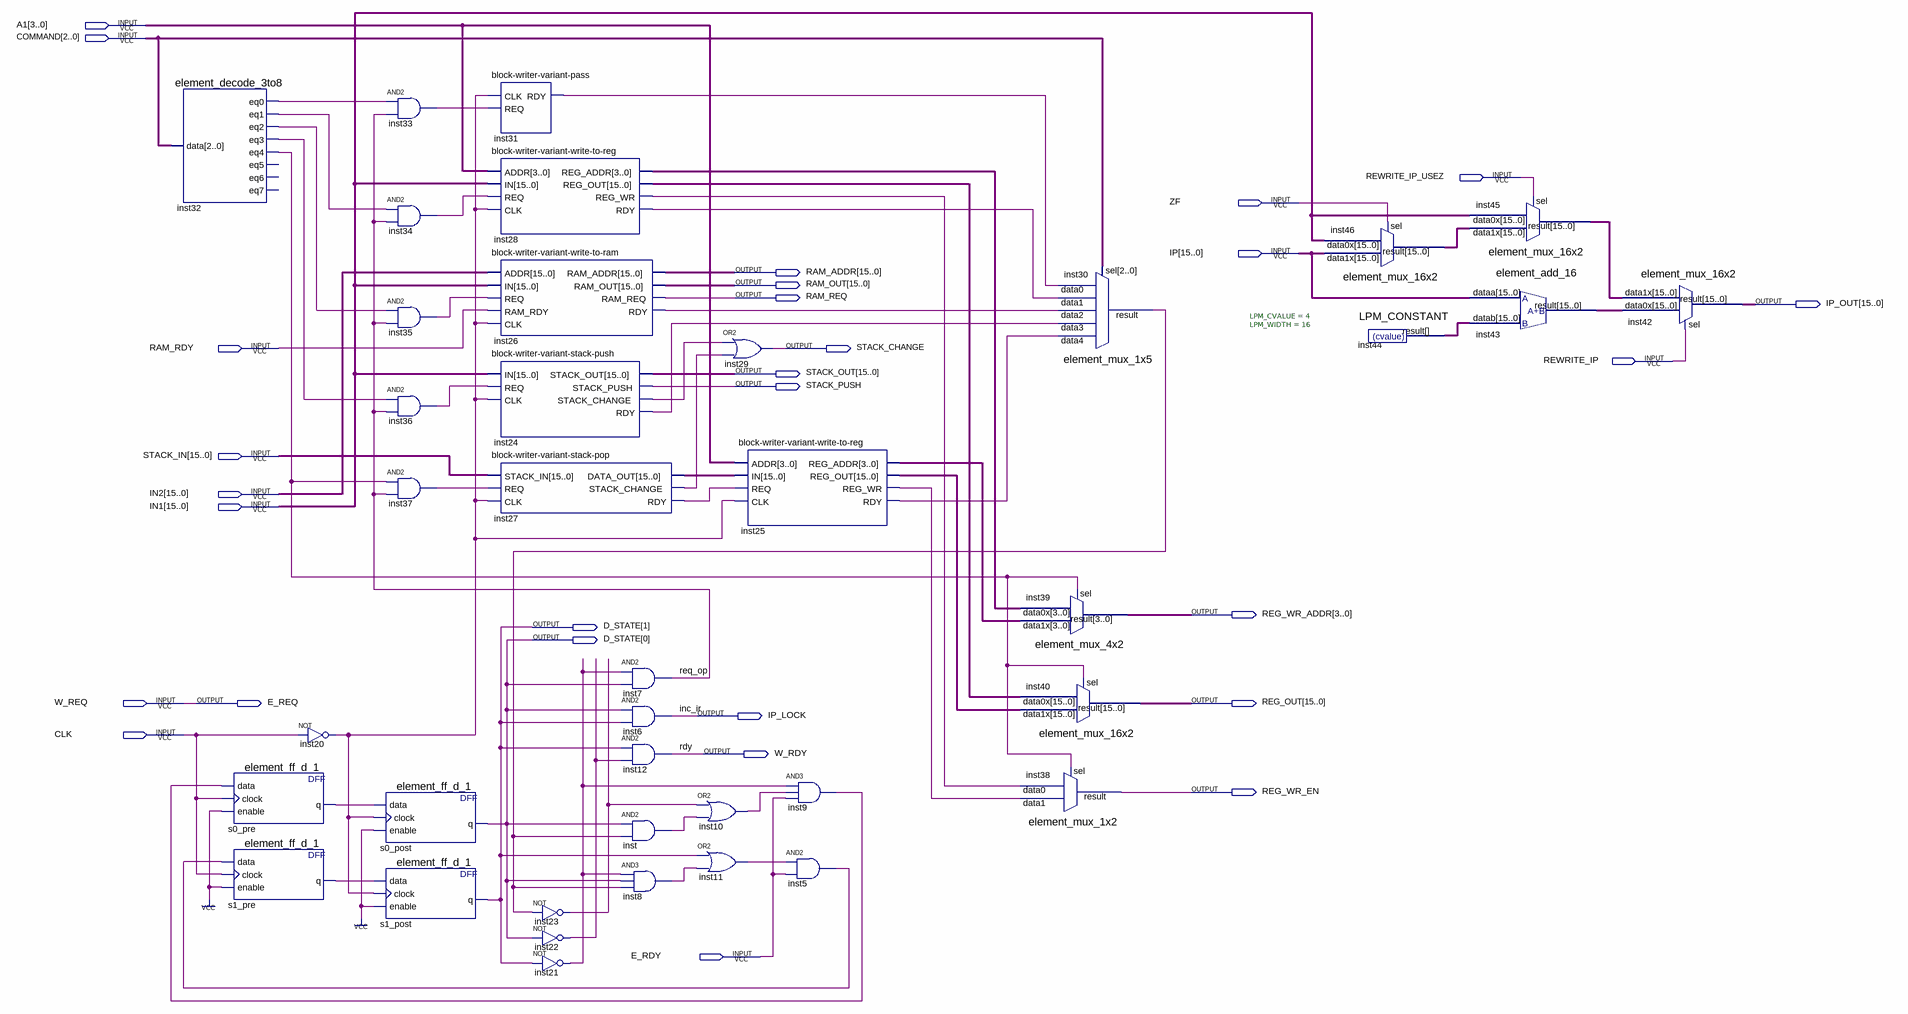
[diagram p0: schematic sheet]
// Quartus schematic block-stage-data-write.bdf as structural Verilog: 39 symbols, 28 pins
module \block-stage-data-write  (
  input  [3:0] A1,
  input  [2:0] COMMAND,
  input  REWRITE_IP_USEZ,
  input  ZF,
  input  [15:0] IP,
  input  RAM_RDY,
  input  REWRITE_IP,
  input  [15:0] STACK_IN,
  input  [15:0] IN2,
  input  [15:0] IN1,
  input  W_REQ,
  input  CLK,
  input  E_RDY,
  output [15:0] RAM_ADDR,
  output [15:0] RAM_OUT,
  output RAM_REQ,
  output [15:0] IP_OUT,
  output STACK_CHANGE,
  output [15:0] STACK_OUT,
  output STACK_PUSH,
  output [3:0] REG_WR_ADDR,
  output [1:0] D_STATE,
  output E_REQ,
  output [15:0] REG_OUT,
  output IP_LOCK,
  output W_RDY,
  output REG_WR_EN
);

  wire inst5_out, inst8_out, inst9_out, inst10_out, inst11_out, inst20_out, inst21_out, inst22_out,
       inst23_out, inst24_rdy, inst24_stack_change, inst25_rdy, inst25_reg_wr, inst26_rdy, inst27_rdy,
       inst27_stack_change, inst28_rdy, inst28_reg_wr, inst30_result, inst31_rdy, inst32_eq0, inst32_eq1,
       inst32_eq2, inst32_eq3, inst32_eq4, inst33_out, inst34_out, inst35_out, inst36_out, inst37_out,
       inst_out, req_op, s0_pre_q, s1_pre_q;
  wire [3:0] inst25_reg_addr, inst28_reg_addr;
  wire [15:0] inst25_reg_out, inst27_data_out, inst28_reg_out, inst43_result, inst44_result, inst45_result,
       inst46_result;

  element_decode_3to8 inst32 (
    .data(COMMAND), .eq0(inst32_eq0), .eq1(inst32_eq1), .eq2(inst32_eq2), .eq3(inst32_eq3), .eq4(inst32_eq4));  // open: eq5, eq6, eq7
  element_ff_d_1 s0_pre (.data(inst9_out), .clock(CLK), .enable(1'b1), .q(s0_pre_q));
  element_ff_d_1 s1_pre (.data(inst5_out), .clock(CLK), .enable(1'b1), .q(s1_pre_q));
  not inst20 (inst20_out, CLK);
  element_ff_d_1 s0_post (.data(s0_pre_q), .clock(inst20_out), .enable(1'b1), .q(D_STATE[0]));
  element_ff_d_1 s1_post (.data(s1_pre_q), .clock(inst20_out), .enable(1'b1), .q(D_STATE[1]));
  and inst33 (inst33_out, inst32_eq0, req_op);
  and inst34 (inst34_out, inst32_eq1, req_op);
  and inst35 (inst35_out, inst32_eq2, req_op);
  and inst36 (inst36_out, inst32_eq3, req_op);
  and inst37 (inst37_out, inst32_eq4, req_op);
  \block-writer-variant-pass  inst31 (.CLK(inst20_out), .REQ(inst33_out), .RDY(inst31_rdy));
  \block-writer-variant-write-to-reg  inst28 (
    .ADDR(A1), .IN(IN1), .REQ(inst34_out), .CLK(inst20_out), .REG_ADDR(inst28_reg_addr),
    .REG_OUT(inst28_reg_out), .REG_WR(inst28_reg_wr), .RDY(inst28_rdy));
  \block-writer-variant-write-to-ram  inst26 (
    .ADDR(IN2), .IN(IN1), .REQ(inst35_out), .RAM_RDY(RAM_RDY), .CLK(inst20_out), .RAM_ADDR(RAM_ADDR),
    .RAM_OUT(RAM_OUT), .RAM_REQ(RAM_REQ), .RDY(inst26_rdy));
  \block-writer-variant-stack-push  inst24 (
    .IN(IN1), .REQ(inst36_out), .CLK(inst20_out), .STACK_OUT(STACK_OUT), .STACK_PUSH(STACK_PUSH),
    .STACK_CHANGE(inst24_stack_change), .RDY(inst24_rdy));
  \block-writer-variant-stack-pop  inst27 (
    .STACK_IN(STACK_IN), .REQ(inst37_out), .CLK(inst20_out), .DATA_OUT(inst27_data_out),
    .STACK_CHANGE(inst27_stack_change), .RDY(inst27_rdy));
  not inst23 (inst23_out, inst30_result);
  not inst22 (inst22_out, D_STATE[0]);
  not inst21 (inst21_out, D_STATE[1]);
  and inst7 (req_op, inst21_out, D_STATE[0]);
  and inst6 (IP_LOCK, D_STATE[0], D_STATE[1]);
  and inst12 (W_RDY, D_STATE[1], inst22_out);
  and inst (inst_out, D_STATE[0], inst30_result);
  and inst8 (inst8_out, inst21_out, D_STATE[0], inst30_result);
  or inst29 (STACK_CHANGE, inst24_stack_change, inst27_stack_change);
  or inst10 (inst10_out, inst23_out, inst_out);
  or inst11 (inst11_out, D_STATE[1], inst8_out);
  \block-writer-variant-write-to-reg  inst25 (
    .ADDR(A1), .IN(inst27_data_out), .REQ(inst27_rdy), .CLK(inst20_out), .REG_ADDR(inst25_reg_addr),
    .REG_OUT(inst25_reg_out), .REG_WR(inst25_reg_wr), .RDY(inst25_rdy));
  and inst9 (inst9_out, inst21_out, inst10_out, E_RDY);
  and inst5 (inst5_out, inst11_out, E_RDY);
  element_mux_4x2 inst39 (.data1x(inst25_reg_addr), .data0x(inst28_reg_addr), .sel(inst32_eq4), .result(REG_WR_ADDR));
  element_mux_16x2 inst40 (.data1x(inst25_reg_out), .data0x(inst28_reg_out), .sel(inst32_eq4), .result(REG_OUT));
  element_mux_1x2 inst38 (.data1(inst25_reg_wr), .data0(inst28_reg_wr), .sel(inst32_eq4), .result(REG_WR_EN));
  element_mux_1x5 inst30 (
    .data4(inst25_rdy), .data3(inst24_rdy), .data2(inst26_rdy), .data1(inst28_rdy), .data0(inst31_rdy),
    .sel(COMMAND), .result(inst30_result));
  element_mux_16x2 inst46 (.data1x(IP), .data0x(IN1), .sel(ZF), .result(inst46_result));
  LPM_CONSTANT #(.LPM_CVALUE(4), .LPM_WIDTH(16)) inst44 (.result(inst44_result));
  element_mux_16x2 inst45 (.data1x(inst46_result), .data0x(IN1), .sel(REWRITE_IP_USEZ), .result(inst45_result));
  element_add_16 inst43 (.dataa(IP), .datab(inst44_result), .result(inst43_result));
  element_mux_16x2 inst42 (.data1x(inst45_result), .data0x(inst43_result), .sel(REWRITE_IP), .result(IP_OUT));

  assign E_REQ = W_REQ;

  // Other names for the same wires on the sheet: inc_ir = IP_LOCK; rdy = W_RDY
endmodule
